# Altium schematic sheet Sheet_1_2024-06-24.schdoc
size 133 x 143 mm
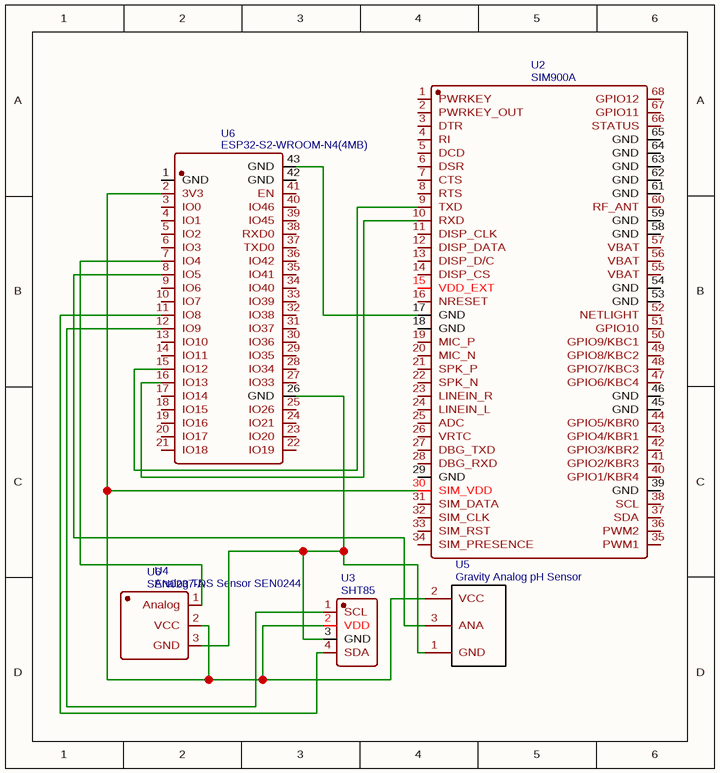
[diagram p0: Sheet_1_2024-06-24.schdoc]

## Parts
U2  SIM900A  [GSMM_SMD_SIM900A]
U3  SHT85  [SHT85]
U4  Analog TDS Sensor SEN0244
U5  Gravity Analog pH Sensor  [ATLAS SCIENTIFIC - GRAVITY SENSOR]
U6  ESP32-S2-WROOM-N4(4MB)  [WIFI-SMD_ESP32-S2-WROVER-I]

## Nets
NetU2_9: U2.9(TXD) U6.15(IO12)
NetU2_10: U2.10(RXD) U6.16(IO13)
NetU2_17: U2.17(GND) U6.43(GND)
NetU2_30: U2.30(SIM_VDD) U3.2(VDD) U4.2(VCC) U5.2(VCC) U6.2(3V3)
NetU3_1: U3.1(SCL) U6.12(IO9)
NetU3_3: U3.3(GND) U4.3(GND) U5.1(GND) U6.26(GND)
NetU3_4: U3.4(SDA) U6.11(IO8)
NetU4_1: U4.1(Analog) U6.7(IO4)
NetU5_3: U5.3(ANA) U6.8(IO5)

Not connected (* = marked no-connect by the designer): U2 1(PWRKEY) 2(PWRKEY_OUT) 3(DTR) 4(RI) 5(DCD) 6(DSR) 7(CTS) 8(RTS) 11(DISP_CLK) 12(DISP_DATA) 13(DISP_D/C) 14(DISP_CS) 15(VDD_EXT) 16(NRESET) 18(GND) 19(MIC_P) 20(MIC_N) 21(SPK_P) 22(SPK_N) 23(LINEIN_R) 24(LINEIN_L) 25(ADC) 26(VRTC) 27(DBG_TXD) 28(DBG_RXD) 29(GND) 31(SIM_DATA) 32(SIM_CLK) 33(SIM_RST) 34(SIM_PRESENCE) 35(PWM1) 36(PWM2) 37(SDA) 38(SCL) 39(GND) 40(GPIO1/KBR4) 41(GPIO2/KBR3) 42(GPIO3/KBR2) 43(GPIO4/KBR1) 44(GPIO5/KBR0) 45(GND) 46(GND) 47(GPIO6/KBC4) 48(GPIO7/KBC3) 49(GPIO8/KBC2) 50(GPIO9/KBC1) 51(GPIO10) 52(NETLIGHT) 53(GND) 54(GND) 55(VBAT) 56(VBAT) 57(VBAT) 58(GND) 59(GND) 60(RF_ANT) 61(GND) 62(GND) 63(GND) 64(GND) 65(GND) 66(STATUS) 67(GPIO11) 68(GPIO12); U6 1(GND) 3(IO0) 4(IO1) 5(IO2) 6(IO3) 9(IO6) 10(IO7) 13(IO10) 14(IO11) 17(IO14) 18(IO15) 19(IO16) 20(IO17) 21(IO18) 22(IO19) 23(IO20) 24(IO21) 25(IO26) 27(IO33) 28(IO34) 29(IO35) 30(IO36) 31(IO37) 32(IO38) 33(IO39) 34(IO40) 35(IO41) 36(IO42) 37(TXD0) 38(RXD0) 39(IO45) 40(IO46) 41(EN) 42(GND)

## Notes on the sheet
- (in symbol Analog TDS Sensor SEN0244) U6; SEN0237-A

## Library data of the parts
U2 = SIM900A: Manufacturer: null; Contributor: LCSC; Supplier: LCSC; Supplier Part: C9900000398; Manufacturer Part: SIM900A; JLCPCB Part Class: Extended Part; spicePre: U; spiceSymbolName: SIM900A
U3 = SHT85: Contributor: zsamora; spicePre: U; spiceSymbolName: SHT85
U4 = Analog TDS Sensor SEN0244: Contributor: 陳詩函; spicePre: U; spiceSymbolName: Analog TDS Sensor SEN0244
U5 = Gravity Analog pH Sensor: Manufacturer: Atlas Scientific; Manufacturer Part: GRV-pH; Contributor: ajannin82; link: https://atlas-scientific.com/embedded-solutions/gravity-analog-ph-sensor-meter/; spicePre: U; spiceSymbolName: Gravity Analog pH Sensor
U6 = ESP32-S2-WROOM-N4(4MB): Manufacturer: ESPRESSIF(乐鑫); Contributor: lcsc; Supplier: LCSC; Supplier Part: C7463336; Manufacturer Part: ESP32-S2-WROOM-N4(4MB); JLCPCB Part Class: Extended Part; spicePre: U; spiceSymbolName: ESP32-S2-WROOM-N4(4MB)